# EAGLE schematic BBBCapeWithBat (EAGLE 7.2.0)
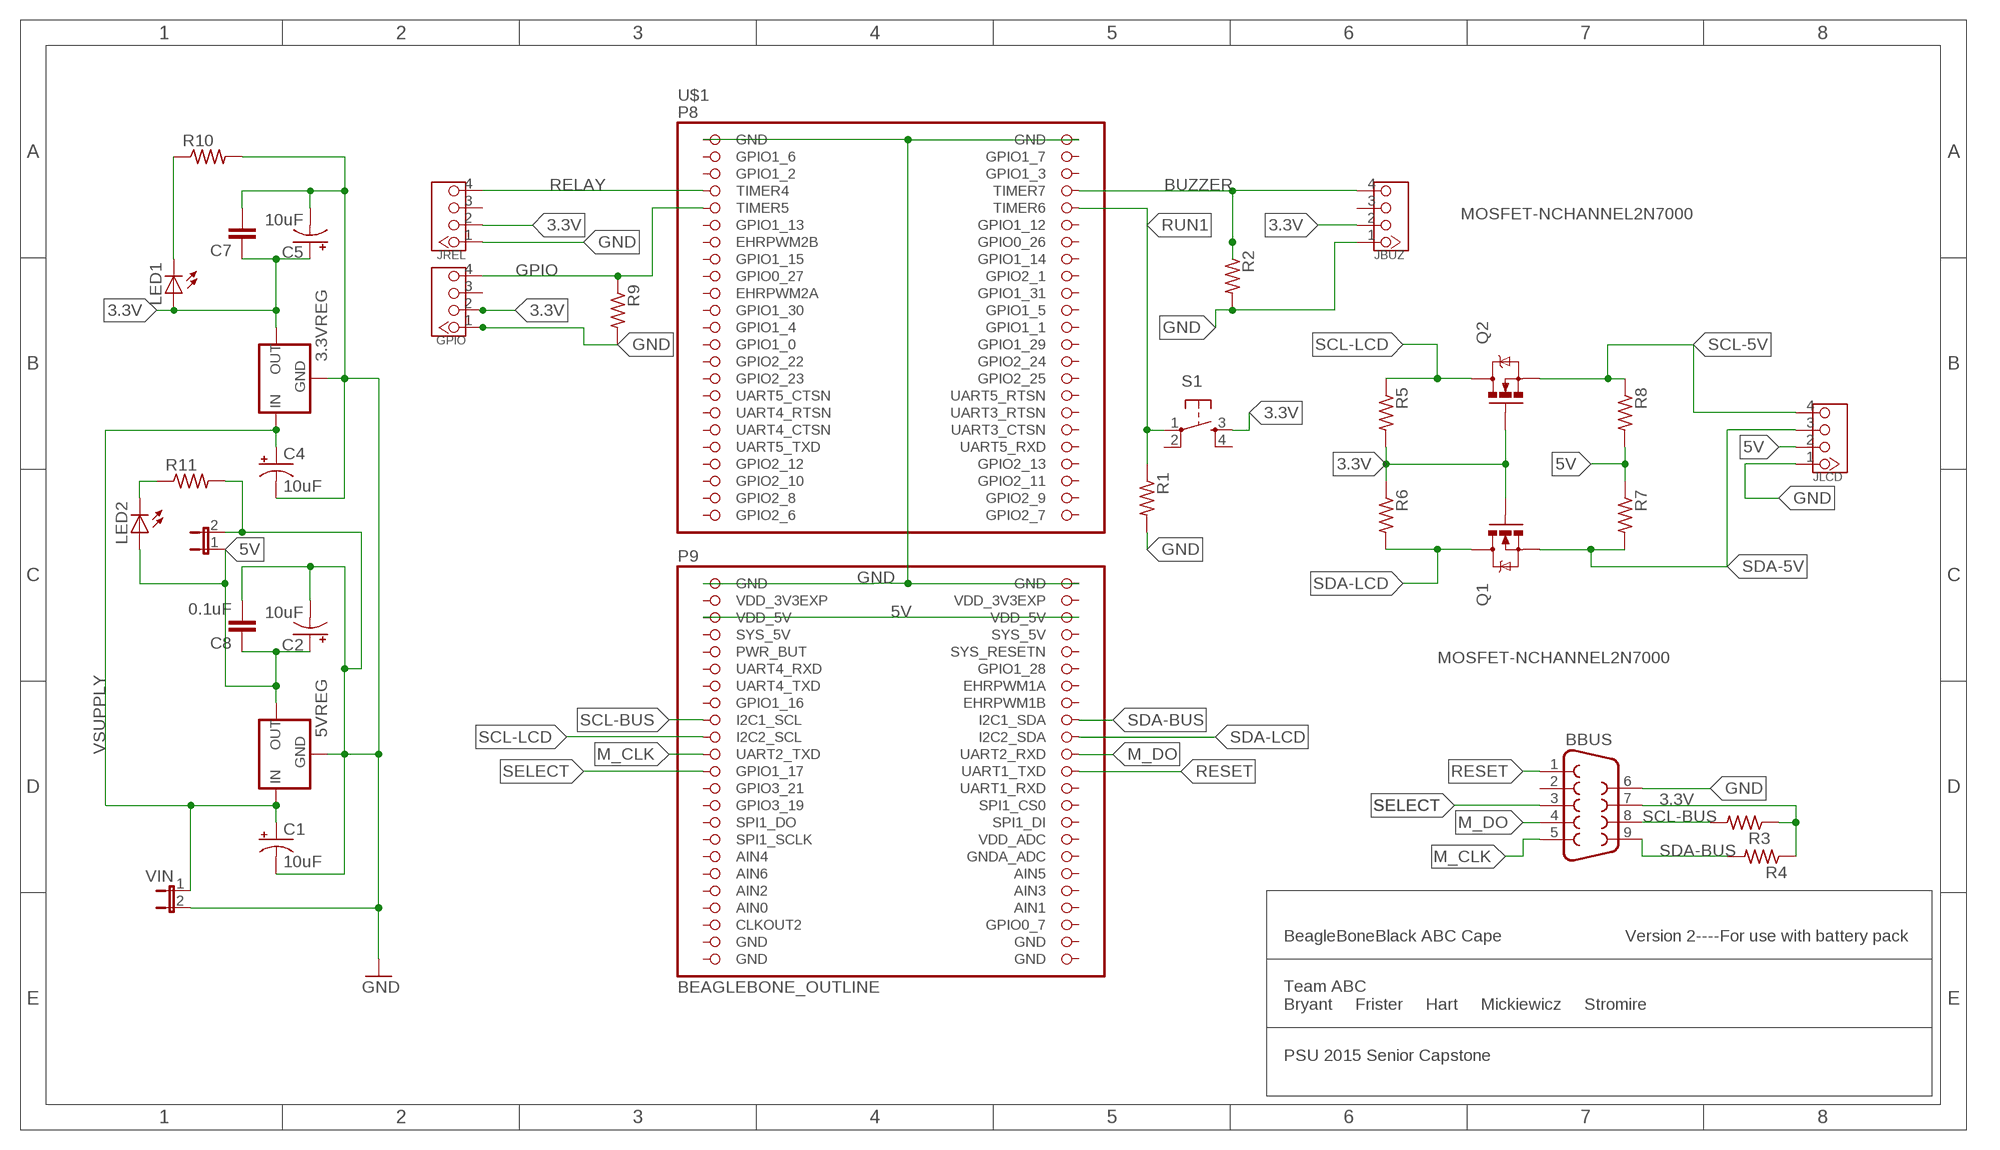
[diagram p0: schematic, sheet 1]

## Parts
3.3VREG  78XXS  [78XXS]
5VOUT  JUMPER-2PTH  [1X02]
5VREG  78XXS  [78XXS]
BBUS  F09H  [F09H]
C1  10uF  CAP_POLPTH2  [CPOL-RADIAL-10UF-25V]
C2  10uF  CAP_POLPTH2  [CPOL-RADIAL-10UF-25V]
C4  10uF  CAP_POLPTH2  [CPOL-RADIAL-10UF-25V]
C5  10uF  CAP_POLPTH2  [CPOL-RADIAL-10UF-25V]
C7  CAPPTH2  [CAP-PTH-SMALL2]
C8  0.1uF  CAPPTH2  [CAP-PTH-SMALL2]
GPIO  TWIG-4P-2.0-2.0  [4P-2.0]
JBUZ  TWIG-4P-2.0-2.0  [4P-2.0]
JLCD  TWIG-4P-2.0-2.0  [4P-2.0]
JREL  TWIG-4P-2.0-2.0  [4P-2.0]
LED1  LED3MM  [LED3MM]
LED2  LED3MM  [LED3MM]
Q1  MOSFET-NCHANNEL2N7000  [TO-92]
Q2  MOSFET-NCHANNEL2N7000  [TO-92]
R1  R-US_0204/2V  [0204V]
R2  R-US_0204/2V  [0204V]
R3  R-US_0204/2V  [0204V]
R4  R-US_0204/2V  [0204V]
R5  R-US_0204/2V  [0204V]
R6  R-US_0204/2V  [0204V]
R7  R-US_0204/2V  [0204V]
R8  R-US_0204/2V  [0204V]
R9  R-US_0204/2V  [0204V]
R10  R-US_0204/2V  [0204V]
R11  R-US_0204/2V  [0204V]
S1  TAC_SWITCHPTH  [TACTILE-PTH]
U$1  BEAGLEBONE_OUTLINE  [BEAGLEBONE_SHIELD]
VIN  JUMPER-2PTH  [1X02]

## Nets
3.3V: 3.3VREG.OUT BBUS.7 C5.1(+) C7.1 GPIO.2 JBUZ.2 JREL.2 LED1.A Q1.2(G) Q2.2(G) R3.1 R4.1 R5.2 R6.1 S1.3
5V: 5VOUT.1 5VREG.OUT C2.1(+) C8.1 JLCD.2 LED2.A R7.1 R8.2 U$1.51(VDD_5V) U$1.52(VDD_5V)
BUZZER: JBUZ.4 R2.1 U$1.8(TIMER7)
GND: 3.3VREG.GND 5VOUT.2 5VREG.GND BBUS.6 C1.2(-) C2.2(-) C4.2(-) C5.2(-) C7.2 C8.2 GPIO.1 JBUZ.1 JLCD.1 JREL.1 R1.2 R2.2 R9.2 R10.2 R11.2 U$1.1(GND) U$1.2(GND) U$1.47(GND) U$1.48(GND) VIN.2
GPIO: GPIO.4 R9.1 U$1.9(TIMER5)
M_CLK: BBUS.5 U$1.67(UART2_TXD)
M_DO: BBUS.4 U$1.68(UART2_RXD)
N$2: LED2.K(C) R11.1
N$4: LED1.K(C) R10.1
RELAY: JREL.4 U$1.7(TIMER4)
RESET: BBUS.1 U$1.70(UART1_TXD)
RUN1: R1.1 S1.1 U$1.10(TIMER6)
SCL-5V: JLCD.4 Q2.1(S) R8.1
SCL-BUS: BBUS.8 R3.2 U$1.63(I2C1_SCL)
SCL-LCD: Q2.3(D) R5.1 U$1.65(I2C2_SCL)
SDA-5V: JLCD.3 Q1.1(S) R7.2
SDA-BUS: BBUS.9 R4.2 U$1.64(I2C1_SDA)
SDA-LCD: Q1.3(D) R6.2 U$1.66(I2C2_SDA)
SELECT: BBUS.3 U$1.69(GPIO1_17)
VSUPPLY: 3.3VREG.IN 5VREG.IN C1.1(+) C4.1(+) VIN.1
Unconnected: BBUS.2 GPIO.3 JBUZ.3 JREL.3 S1.2 S1.4 U$1.3(GPIO1_6) U$1.4(GPIO1_7) U$1.5(GPIO1_2) U$1.6(GPIO1_3) U$1.11(GPIO1_13) U$1.12(GPIO1_12) U$1.13(EHRPWM2B) U$1.14(GPIO0_26) U$1.15(GPIO1_15) U$1.16(GPIO1_14) U$1.17(GPIO0_27) U$1.18(GPIO2_1) U$1.19(EHRPWM2A) U$1.20(GPIO1_31) U$1.21(GPIO1_30) U$1.22(GPIO1_5) U$1.23(GPIO1_4) U$1.24(GPIO1_1) U$1.25(GPIO1_0) U$1.26(GPIO1_29) U$1.27(GPIO2_22) U$1.28(GPIO2_24) U$1.29(GPIO2_23) U$1.30(GPIO2_25) U$1.31(UART5_CTSN) U$1.32(UART5_RTSN) U$1.33(UART4_RTSN) U$1.34(UART3_RTSN) U$1.35(UART4_CTSN) U$1.36(UART3_CTSN) U$1.37(UART5_TXD) U$1.38(UART5_RXD) U$1.39(GPIO2_12) U$1.40(GPIO2_13) U$1.41(GPIO2_10) U$1.42(GPIO2_11) U$1.43(GPIO2_8) U$1.44(GPIO2_9) U$1.45(GPIO2_6) U$1.46(GPIO2_7) U$1.54(SYS_5V) U$1.55(PWR_BUT) U$1.56(SYS_RESETN) U$1.57(UART4_RXD) U$1.58(GPIO1_28) U$1.59(UART4_TXD) U$1.60(EHRPWM1A) U$1.61(GPIO1_16) U$1.62(EHRPWM1B) U$1.71(GPIO3_21) U$1.72(UART1_RXD) U$1.73(GPIO3_19) U$1.74(SPI1_CS0) U$1.75(SPI1_DO) U$1.76(SPI1_DI) U$1.77(SPI1_SCLK) U$1.78(VDD_ADC) U$1.79(AIN4) U$1.80(GNDA_ADC) U$1.81(AIN6) U$1.82(AIN5) U$1.83(AIN2) U$1.84(AIN3) U$1.86(AIN1) U$1.87(CLKOUT2) U$1.88(GPIO0_7)

## Notes on the sheet
- BeagleBoneBlack ABC Cape | Version 2----For use with battery pack
- Team ABC             
  Bryant     Frister     Hart     Mickiewicz     Stromire
- PSU 2015 Senior Capstone

## Power pins joined to a net without a drawn wire
AIN0: U$1.85(AIN0)
GND: U$1.89(GND) U$1.90(GND) U$1.91(GND) U$1.92(GND)
SYS_5V: U$1.53(SYS_5V)
VDD_3V3EXP: U$1.49(VDD_3V3EXP) U$1.50(VDD_3V3EXP)

## Library data of the parts
3.3VREG 5VREG = v-reg:78XXS: VOLTAGE REGULATOR
5VOUT VIN = SparkFun-Passives:JUMPER-2: Jumper Basic 0.1" spaced jumper. Use with breakaway headers.
BBUS = con-subd:F09: SUB-D; OC_FARNELL: unknown; OC_NEWARK: unknown
C1 C2 C4 C5 = SparkFun-Capacitors:CAP_POL: Capacitor Polarized These are standard SMD and PTH capacitors. Normally 10uF, 47uF, and 100uF in electrolytic and tantalum varieties. Always verify the external diameter of the through hole cap, it varies with capacity, voltage, and manufacturer. The EIA devices should be standard.
C7 C8 = SparkFun-Passives:CAP: Capacitor Standard 0603 ceramic capacitor, and 0.1" leaded capacitor.
GPIO JBUZ JLCD JREL = Connector:TWIG-4P-2.0
LED1 LED2 = adafruit:LED: LED OSRAM: - CHIPLED LG R971, LG N971, LY N971, LG Q971, LY Q971, LO R971, LY R971 LH N974, LH R974 LS Q976, LO Q976, LY Q976 LO Q996 - Hyper CHIPLED LW Q18S LB Q993, LB Q99A, LB R99A - SideLED LS A670, LO A670, LY A670, LG A670, LP A670 LB A673, LV A673, LT A673, LW A673 LH A674 LY A675 LS A676, LA A676, LO A676, LY A676, LW A676 LS A679, LY A679, LG A679 - Hyper Micro SIDELED® LS Y876, LA Y876, LO Y876, LY Y876 LT Y87S - SmartLED LW L88C, LW L88S LB L89C, LB L89S, LG L890 LS L89K, LO L89K, LY L89K LS L896, LA L896, LO L896, LY L896 - TOPLED LS T670, LO T670, LY T670, LG T670, LP T670 LSG T670, LSP T670, LSY T670, LOP T670, LYG T670 LG T671, LOG T671, LSG T671 LB T673, LV T673, LT T673, LW T673 LH T674 LS T676, LA T676, LO T676, LY T676, LB T676, LH T676, LSB T676, LW T676 LB T67C, LV T67C, LT T67C, LS T67K, LO T67K, LY T67K, LW E67C LS E67B, LA E67B, LO E67B, LY E67B, LB E67C, LV E67C, LT E67C LW T67C LS T679, LY T679, LG T679 LS T770, LO T770, LY T770, LG T770, LP T770 LB T773, LV T773, LT T773, LW T773 LH T774 LS E675, LA E675, LY E675, LS T675 LS T776, LA T776, LO T776, LY T776, LB T776 LHGB T686 LT T68C, LB T68C - Hyper Mini TOPLED® LB M676 - Mini TOPLED Santana® LG M470 LS M47K, LO M47K, LY M47K Source: http://www.osram.convergy.de/
Q1 Q2 = SparkFun-DiscreteSemi:MOSFET-NCHANNEL: Common NMOSFET Parts MFG P/N Store ID Prod ID FDD8780 TRANS-09984 SI7820DN TRANS-11055 FDS6630A IC-08089 2N7002PW TRANS-11151 FQP30N06L COM-10213 TRANS-10060 BSS123LT1G TRANS-08345 BSS138 TRANS-00830 BS170 2N7000
R1-R11 = adafruit:R-US_: RESISTOR, American symbol
S1 = SparkFun-Electromechanical:TAC_SWITCH: Momentary Switch Button commonly used for reset or general input. Spark Fun Electronics SKU : COM-00097 SMT- SWCH-08247
U$1 = adafruit:BEAGLEBONE_OUTLINE: Should match A3 pinout - but not completely tested